# Altium schematic sheet soldeerboutaansturing.SchDoc
size A4; SheetNumber: 1; SheetTotal: 5
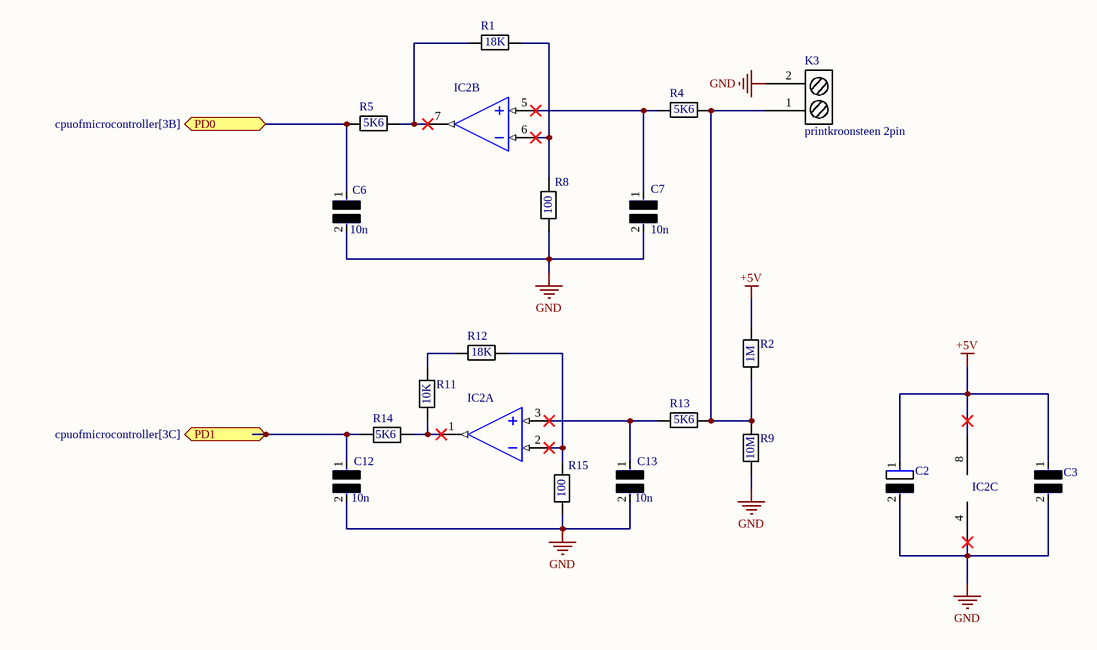
[diagram p0: soldeerboutaansturing.SchDoc]

## Parts
C2  (no value)  [RESC2013X50X30LL20T20]
C3  (no value)  [RESC2013X50X30LL20T20]
C6  10n  [RESC2013X50X30LL20T20]
C7  10n  [RESC2013X50X30LL20T20]
C12  10n  [RESC2013X50X30LL20T20]
C13  10n  [RESC2013X50X30LL20T20]
IC2  OPAMP  [DIP781W56P254L950H533Q8N]  (value not drawn)  (parts A,B,C of 3)
K3  printkroonsteen 2pin  [printkroonsteen 2pin]
R1  18K  [RESC2013X50X30LL20T20]
R2  1M  [RESC2013X50X30LL20T20]
R4  5K6  [RESC2013X50X30LL20T20]
R5  5K6  [RESC2013X50X30LL20T20]
R8  100  [RESC2013X50X30LL20T20]
R9  10M  [RESC2013X50X30LL20T20]
R11  10K  [RESC2013X50X30LL20T20]
R12  18K  [RESC2013X50X30LL20T20]
R13  5K6  [RESC2013X50X30LL20T20]
R14  5K6  [RESC2013X50X30LL20T20]
R15  100  [RESC2013X50X30LL20T20]

## Ports
PD0 (bidir, see cpuofmicrocontroller[3B]), PD1 (bidir, see cpuofmicrocontroller[3C])

## Nets
+5V: C2.1 C3.1 IC2.8 R2.2
GND: C2.2 C3.2 C6.2 C7.2 C12.2 C13.2 IC2.4 K3.2 R8.1 R9.1 R15.1
PD0: C6.1 R5.1 ; port PD0
PD1: C12.1 R14.2 ; port PD1
NetC7_1: C7.1 IC2.5(VINB+) R4.1
NetC13_1: C13.1 IC2.3(VINA+) R13.1
NetIC2_1: IC2.1(VOUTA) R11.1 R14.1
NetIC2_2: IC2.2(VINA-) R12.2 R15.2
NetIC2_6: IC2.6(VINB-) R1.2 R8.2
NetIC2_7: IC2.7(VOUTB) R1.1 R5.2
NetK3_1: K3.1 R2.1 R4.2 R9.2 R13.2
NetR11_2: R11.2 R12.1

## Library data of the parts
C2 = Elektrolytische Capacitor: CAP CER 0.1UF 10V X5R 0402; Manufacturer: Kemet; Manufacturer Part Number: C0402C104K8PACTU; Material: Ceramic; Capacitance: 0.10 μF; Temperature Coefficient: 15%; Tolerance: 0.1; Value: 0.10 μF; Package: C0402-BB; Temperature: -55°C to +125°C; ComponentLink2Description: Datasheet; Temperature Characteristic: X5R; Device Class L1: Passive Components; Height: 0.55mm; Lead Free: Yes; ComponentLink2URL: https://content.kemet.com/datasheets/KEM_C1002_X7R_SMD.pdf; Device Class L2: Capacitors; Temperature Range Low: -55°C; Temperature Range High: +125°C; RoHS: TRUE; Octopart: https://octopart.com/c0402c104k8pactu-kemet-140039; Automotive: No; Mouser Description: Capacitor 100 nF 10 VDC 0402 | KEMET C0402C104K8PACTU (Capacitor 100 nF 10 VDC 0402 Ceramic Capacitors).; Category: Cap; Voltage Rating: 10 V; Digikey Description: CAP CER 0.1UF 10V X5R 0402; Ipc Land Pattern Name: CAPC10050X50; Device Class L3: Ceramic Capacitors
C3 = Ceramische Capacitor
C6 C7 C12 C13 = capacitor2
IC2 = OPAMP: CMP-0187-00133-3; Slew Rate: 0.6V/µs; Supply Current: 100uA; Power Supply Rejection Ratio (PSRR): 86dB; Input Offset Voltage (Vos): 4.5mV; Input Bias Current: 1pA; Amplifier Type: GENERAL PURPOSE; Unity Gain Bandwidth Product: 1MHz; Number of Circuits: 2; Output Current: 23mA; Operating Supply Voltage: 5.5V; Min Supply Voltage: 1.8V; Common Mode Rejection Ratio: 60dB; Voltage Gain: 112dB; Max Supply Voltage: 6V; Package Quantity: 60; REACH SVHC: No SVHC; Min Operating Temperature: -40°C; Max Operating Temperature: 125°C; Mount: Through Hole; Nominal Supply Current: 100uA; Height: 3.3mm; Length: 9.27mm; Slew Rate-Nom: 0.6V/µs; Packaging: Rail/Tube; Output Current per Channel: 23mA; Number of Amplifiers: 2; RoHS Compliant: Yes; Radiation Hardening: No; Bandwidth: 1MHz; Lead Free: Lead Free; Width: 6.35mm; Number of Channels: 2; Gain Bandwidth Product: 1MHz; Technology: CMOS; Operating Supply Current: 100uA; Number of Elements: 2; Number of Pins: 8; Input Offset Voltage-Max: 4.5mV; Case/Package: PDIP
R1 R2 R4 R5 R8 R9 R11-R15 = weerstand: Manufacturer: Vishay Dale; Part Number: CRCW08050000Z0EA